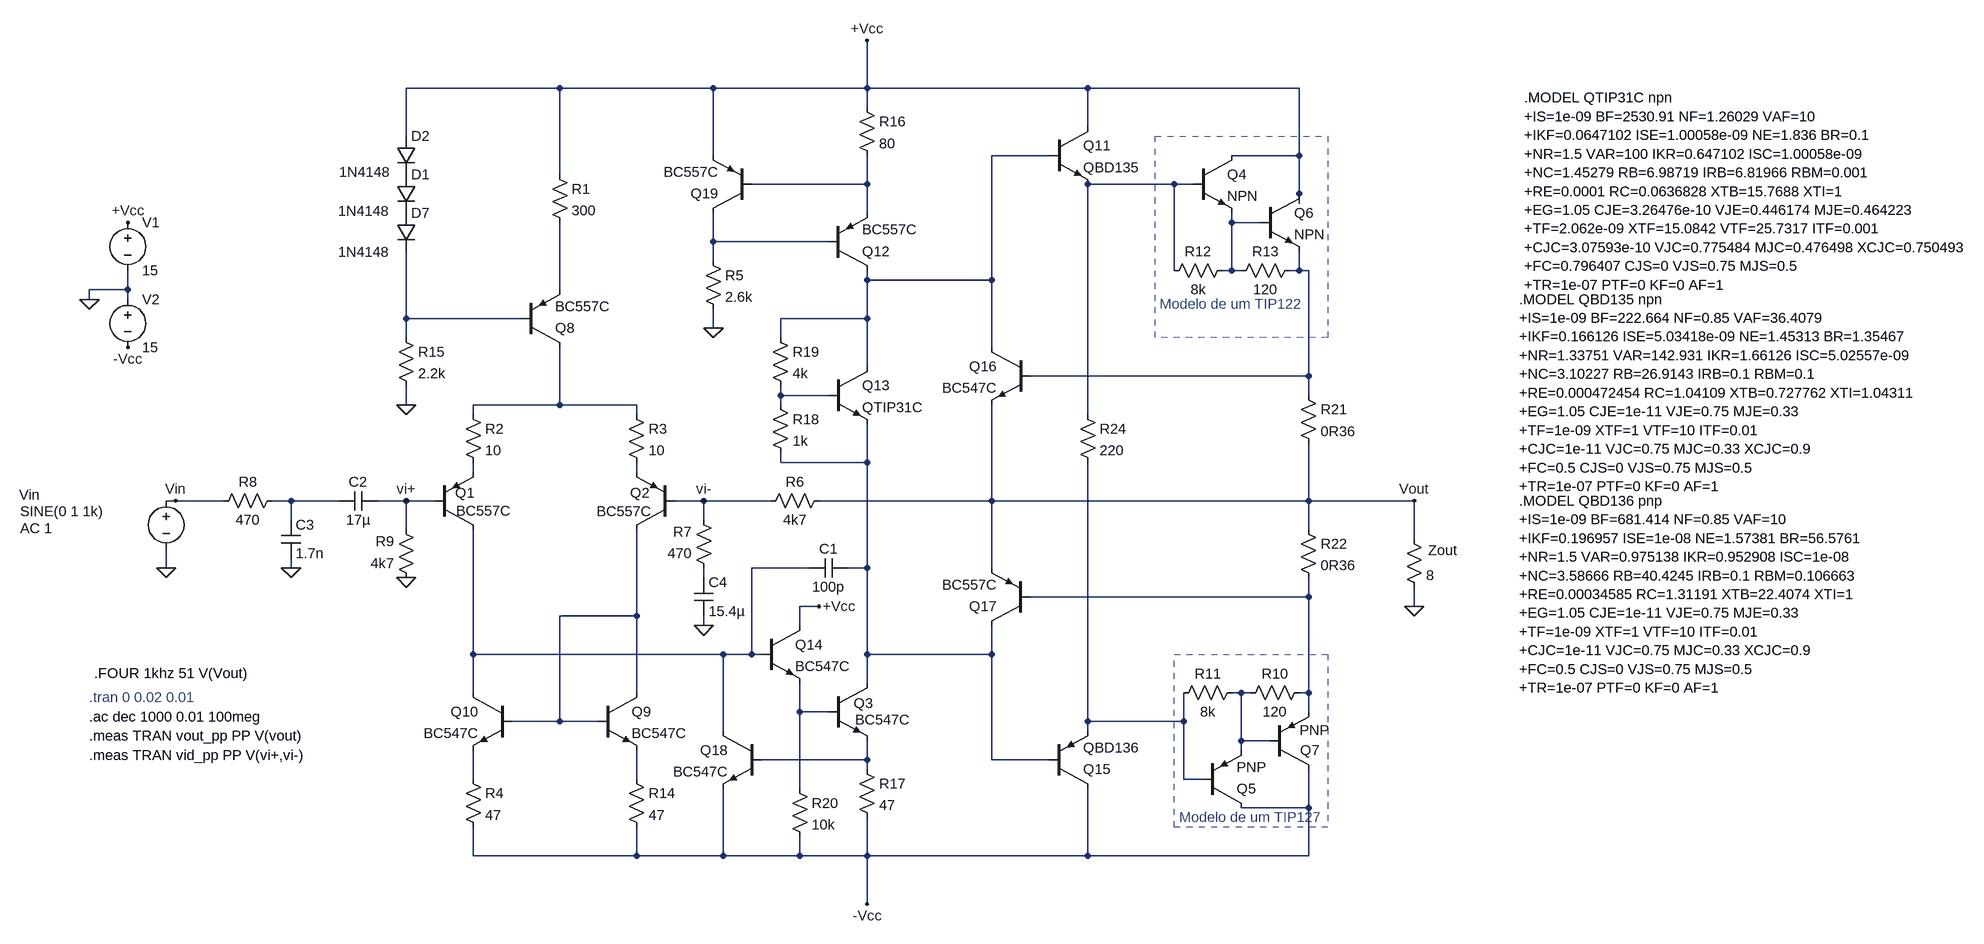
[diagram p0: schematic Amp_v4.asc]
Amp_v4.asc, the LTspice schematic file:
Version 4.1
SHEET 1 2972 1472
WIRE 112 -528 -144 -528
WIRE 368 -528 112 -528
WIRE 624 -528 624 -608
WIRE 624 -528 368 -528
WIRE 992 -528 624 -528
WIRE 1344 -528 992 -528
WIRE 624 -496 624 -528
WIRE 992 -464 992 -528
WIRE -144 -448 -144 -528
WIRE 368 -416 368 -528
WIRE 928 -416 832 -416
WIRE 1344 -416 1344 -528
WIRE 1344 -416 1232 -416
WIRE 112 -384 112 -528
WIRE 624 -368 624 -416
WIRE 624 -368 432 -368
WIRE 1136 -368 992 -368
WIRE 1168 -368 1136 -368
WIRE 1344 -352 1344 -416
WIRE 1344 -336 1344 -352
WIRE 624 -320 624 -368
WIRE 1232 -304 1232 -320
WIRE 1280 -304 1232 -304
WIRE 368 -272 368 -320
WIRE 560 -272 368 -272
WIRE 368 -240 368 -272
WIRE 1136 -224 1136 -368
WIRE 1232 -224 1232 -304
WIRE 1232 -224 1216 -224
WIRE 1248 -224 1232 -224
WIRE 1344 -224 1344 -256
WIRE 1344 -224 1328 -224
WIRE 1360 -224 1344 -224
WIRE 624 -208 624 -224
WIRE 832 -208 832 -416
WIRE 832 -208 624 -208
WIRE -608 -192 -608 -224
WIRE -608 -192 -672 -192
WIRE 112 -192 112 -304
WIRE -672 -176 -672 -192
WIRE -608 -176 -608 -192
WIRE -144 -144 -144 -256
WIRE 48 -144 -144 -144
WIRE 624 -144 624 -208
WIRE 624 -144 480 -144
WIRE 368 -128 368 -160
WIRE -144 -112 -144 -144
WIRE 480 -112 480 -144
WIRE 832 -96 832 -208
WIRE 624 -64 624 -144
WIRE 1360 -48 1360 -224
WIRE 1360 -48 896 -48
WIRE 480 -16 480 -32
WIRE 560 -16 480 -16
WIRE 1360 -16 1360 -48
WIRE -144 0 -144 -32
WIRE 112 0 112 -96
WIRE 112 0 -32 0
WIRE 240 0 112 0
WIRE 480 0 480 -16
WIRE -32 16 -32 0
WIRE 240 16 240 0
WIRE 992 16 992 -368
WIRE 480 96 480 80
WIRE 624 96 624 32
WIRE 624 96 480 96
WIRE -32 112 -32 96
WIRE 240 112 240 96
WIRE -528 160 -544 160
WIRE -448 160 -528 160
WIRE -336 160 -368 160
WIRE -256 160 -336 160
WIRE -144 160 -192 160
WIRE -96 160 -144 160
WIRE 352 160 304 160
WIRE 464 160 352 160
WIRE 832 160 832 0
WIRE 832 160 544 160
WIRE 1360 160 1360 64
WIRE 1360 160 832 160
WIRE 1536 160 1360 160
WIRE -336 192 -336 160
WIRE 352 192 352 160
WIRE -144 208 -144 160
WIRE 1360 208 1360 160
WIRE 1536 224 1536 160
WIRE -544 272 -544 240
WIRE -336 272 -336 256
WIRE 528 272 432 272
WIRE 624 272 624 96
WIRE 624 272 592 272
WIRE 832 272 832 160
WIRE 352 288 352 272
WIRE 1360 320 1360 288
WIRE 1360 320 896 320
WIRE 544 336 512 336
WIRE 1536 336 1536 304
WIRE 240 352 240 208
WIRE 240 352 112 352
WIRE 352 368 352 352
WIRE 512 368 512 336
WIRE -32 416 -32 208
WIRE 384 416 -32 416
WIRE 432 416 432 272
WIRE 432 416 384 416
WIRE 448 416 432 416
WIRE 624 416 624 272
WIRE 832 416 832 368
WIRE 832 416 624 416
WIRE 624 464 624 416
WIRE -32 480 -32 416
WIRE 240 480 240 352
WIRE 1248 480 1232 480
WIRE 1264 480 1248 480
WIRE 1360 480 1360 320
WIRE 1360 480 1344 480
WIRE 512 512 512 464
WIRE 560 512 512 512
WIRE 1360 512 1360 480
WIRE 112 528 112 352
WIRE 112 528 32 528
WIRE 176 528 112 528
WIRE 992 528 992 96
WIRE 1152 528 1152 480
WIRE 1152 528 992 528
WIRE 384 544 384 416
WIRE 992 544 992 528
WIRE 1248 560 1248 480
WIRE 1296 560 1248 560
WIRE 1248 576 1248 560
WIRE 624 592 624 560
WIRE 624 592 448 592
WIRE 832 592 832 416
WIRE 928 592 832 592
WIRE 624 608 624 592
WIRE -32 624 -32 576
WIRE 240 624 240 576
WIRE 1152 624 1152 528
WIRE 1184 624 1152 624
WIRE 512 640 512 512
WIRE 1360 672 1360 608
WIRE 1360 672 1248 672
WIRE -32 752 -32 704
WIRE 240 752 240 704
WIRE 240 752 -32 752
WIRE 384 752 384 640
WIRE 384 752 240 752
WIRE 512 752 512 720
WIRE 512 752 384 752
WIRE 624 752 624 688
WIRE 624 752 512 752
WIRE 992 752 992 640
WIRE 992 752 624 752
WIRE 1360 752 1360 672
WIRE 1360 752 992 752
WIRE 624 832 624 752
FLAG -544 272 0
FLAG -672 -176 0
FLAG -608 -304 +Vcc
FLAG 624 -608 +Vcc
FLAG -608 -96 -Vcc
FLAG 624 832 -Vcc
FLAG -144 288 0
FLAG 352 368 0
FLAG 1536 160 Vout
FLAG 1536 336 0
FLAG -144 0 0
FLAG 368 -128 0
FLAG -144 160 vi+
FLAG 352 160 vi-
FLAG -528 160 Vin
FLAG -336 272 0
FLAG 544 336 +Vcc
SYMBOL voltage -608 -320 R0
WINDOW 123 24 44 Left 2
WINDOW 39 0 0 Left 0
SYMATTR InstName V1
SYMATTR Value 15
SYMBOL voltage -608 -192 R0
WINDOW 123 0 0 Left 0
WINDOW 39 0 0 Left 0
SYMATTR InstName V2
SYMATTR Value 15
SYMBOL voltage -544 144 R0
WINDOW 123 -243 62 Left 2
WINDOW 39 24 152 Left 0
WINDOW 0 -245 6 Left 2
WINDOW 3 -243 34 Left 2
SYMATTR Value2 AC 1
SYMATTR InstName Vin
SYMATTR Value SINE(0 1 1k)
SYMBOL res -48 0 R0
SYMATTR InstName R2
SYMATTR Value 10
SYMBOL res 224 0 R0
SYMATTR InstName R3
SYMATTR Value 10
SYMBOL res 560 144 R90
WINDOW 0 0 56 VBottom 2
WINDOW 3 32 56 VTop 2
SYMATTR InstName R6
SYMATTR Value 4k7
SYMBOL res 368 288 R180
WINDOW 0 36 76 Left 2
WINDOW 3 36 40 Left 2
SYMATTR InstName R7
SYMATTR Value 470
SYMBOL res 1360 464 R90
WINDOW 0 0 56 VBottom 2
WINDOW 3 32 56 VTop 2
SYMATTR InstName R10
SYMATTR Value 120
SYMBOL res 1248 464 R90
WINDOW 0 0 56 VBottom 2
WINDOW 3 32 56 VTop 2
SYMATTR InstName R11
SYMATTR Value 8k
SYMBOL res 1232 -240 R90
WINDOW 0 0 56 VBottom 2
WINDOW 3 32 56 VTop 2
SYMATTR InstName R12
SYMATTR Value 8k
SYMBOL res 1344 -240 R90
WINDOW 0 0 56 VBottom 2
WINDOW 3 32 56 VTop 2
SYMATTR InstName R13
SYMATTR Value 120
SYMBOL cap 592 256 R90
WINDOW 0 0 32 VBottom 2
WINDOW 3 32 32 VTop 2
SYMATTR InstName C1
SYMATTR Value 100p
SYMBOL npn 560 464 R0
WINDOW 0 42 34 Left 2
WINDOW 3 44 61 Left 2
SYMATTR InstName Q3
SYMATTR Value BC547C
SYMBOL npn 1168 -416 R0
SYMATTR InstName Q4
SYMBOL pnp 1184 672 M180
SYMATTR InstName Q5
SYMBOL npn 1280 -352 R0
SYMATTR InstName Q6
SYMBOL pnp 1296 608 M180
WINDOW 0 50 32 Left 2
WINDOW 3 49 65 Left 2
SYMATTR InstName Q7
SYMBOL pnp -96 208 M180
WINDOW 0 34 61 Left 2
WINDOW 3 35 31 Left 2
SYMATTR InstName Q1
SYMATTR Value BC557C
SYMBOL pnp 304 208 R180
WINDOW 0 42 61 Left 2
WINDOW 3 40 30 Left 2
SYMATTR InstName Q2
SYMATTR Value BC557C
SYMBOL res -352 144 R90
WINDOW 0 0 56 VBottom 2
WINDOW 3 32 56 VTop 2
SYMATTR InstName R8
SYMATTR Value 470
SYMBOL res -128 304 R180
WINDOW 0 36 76 Left 2
WINDOW 3 36 40 Left 2
SYMATTR InstName R9
SYMATTR Value 4k7
SYMBOL res 1520 208 R0
WINDOW 0 39 35 Left 2
SYMATTR InstName Zout
SYMATTR Value 8
SYMBOL res -160 -128 R0
SYMATTR InstName R15
SYMATTR Value 2.2k
SYMBOL res 96 -400 R0
SYMATTR InstName R1
SYMATTR Value 300
SYMBOL pnp 48 -96 M180
SYMATTR InstName Q8
SYMATTR Value BC557C
SYMBOL diode -160 -320 R0
WINDOW 3 -97 65 Left 2
SYMATTR Value 1N4148
SYMATTR InstName D7
SYMBOL npn 176 480 R0
SYMATTR InstName Q9
SYMATTR Value BC547C
SYMBOL npn 32 480 M0
SYMATTR InstName Q10
SYMATTR Value BC547C
SYMBOL res -48 608 R0
SYMATTR InstName R4
SYMATTR Value 47
SYMBOL res 224 608 R0
SYMATTR InstName R14
SYMATTR Value 47
SYMBOL res 352 -256 R0
SYMATTR InstName R5
SYMATTR Value 2.6k
SYMBOL pnp 560 -224 M180
SYMATTR InstName Q12
SYMATTR Value BC557C
SYMBOL res 608 592 R0
SYMATTR InstName R17
SYMATTR Value 47
SYMBOL npn 560 -64 R0
SYMATTR InstName Q13
SYMATTR Value QTIP31C
SYMBOL res 464 -16 R0
SYMATTR InstName R18
SYMATTR Value 1k
SYMBOL res 464 -128 R0
SYMATTR InstName R19
SYMATTR Value 4k
SYMBOL npn 448 368 R0
SYMATTR InstName Q14
SYMATTR Value BC547C
SYMBOL res 496 624 R0
SYMATTR InstName R20
SYMATTR Value 10k
SYMBOL diode -160 -384 R0
WINDOW 3 -97 61 Left 2
SYMATTR Value 1N4148
SYMATTR InstName D1
SYMBOL diode -160 -448 R0
WINDOW 3 -96 60 Left 2
SYMATTR Value 1N4148
SYMATTR InstName D2
SYMBOL res 1344 -32 R0
SYMATTR InstName R21
SYMATTR Value 0R36
SYMBOL npn 928 -464 R0
SYMATTR InstName Q11
SYMATTR Value QBD135
SYMBOL pnp 928 640 M180
SYMATTR InstName Q15
SYMATTR Value QBD136
SYMBOL npn 896 -96 M0
SYMATTR InstName Q16
SYMATTR Value BC547C
SYMBOL pnp 896 368 R180
SYMATTR InstName Q17
SYMATTR Value BC557C
SYMBOL res 1344 192 R0
SYMATTR InstName R22
SYMATTR Value 0R36
SYMBOL res 976 0 R0
SYMATTR InstName R24
SYMATTR Value 220
SYMBOL npn 448 544 M0
SYMATTR InstName Q18
SYMATTR Value BC547C
SYMBOL cap 336 288 R0
SYMATTR InstName C4
SYMATTR Value 15.4µ
SYMBOL cap -192 144 R90
WINDOW 0 0 32 VBottom 2
WINDOW 3 32 32 VTop 2
SYMATTR InstName C2
SYMATTR Value 17µ
SYMBOL cap -352 192 R0
SYMATTR InstName C3
SYMATTR Value 1.7n
SYMBOL pnp 432 -320 R180
SYMATTR InstName Q19
SYMATTR Value BC557C
SYMBOL res 608 -512 R0
SYMATTR InstName R16
SYMATTR Value 80
TEXT -672 488 Left 2 ;.tran 0 0.02 0.01
TEXT -664 448 Left 2 !.FOUR 1khz 51 V(Vout)
TEXT 1112 -168 Left 2 ;Modelo de um TIP122
TEXT 1144 688 Left 2 ;Modelo de um TIP127
TEXT -672 520 Left 2 !.ac dec 1000 0.01 100meg
TEXT -672 552 Left 2 !.meas TRAN vout_pp PP V(vout)
TEXT -672 584 Left 2 !.meas TRAN vid_pp PP V(vi+,vi-)
TEXT 2136 -512 Left 2 !.MODEL QTIP31C npn\n+IS=1e-09 BF=2530.91 NF=1.26029 VAF=10\n+IKF=0.0647102 ISE=1.00058e-09 NE=1.836 BR=0.1\n+NR=1.5 VAR=100 IKR=0.647102 ISC=1.00058e-09\n+NC=1.45279 RB=6.98719 IRB=6.81966 RBM=0.001\n+RE=0.0001 RC=0.0636828 XTB=15.7688 XTI=1\n+EG=1.05 CJE=3.26476e-10 VJE=0.446174 MJE=0.464223\n+TF=2.062e-09 XTF=15.0842 VTF=25.7317 ITF=0.001\n+CJC=3.07593e-10 VJC=0.775484 MJC=0.476498 XCJC=0.750493\n+FC=0.796407 CJS=0 VJS=0.75 MJS=0.5\n+TR=1e-07 PTF=0 KF=0 AF=1
TEXT 2128 -176 Left 2 !.MODEL QBD135 npn\n+IS=1e-09 BF=222.664 NF=0.85 VAF=36.4079\n+IKF=0.166126 ISE=5.03418e-09 NE=1.45313 BR=1.35467\n+NR=1.33751 VAR=142.931 IKR=1.66126 ISC=5.02557e-09\n+NC=3.10227 RB=26.9143 IRB=0.1 RBM=0.1\n+RE=0.000472454 RC=1.04109 XTB=0.727762 XTI=1.04311\n+EG=1.05 CJE=1e-11 VJE=0.75 MJE=0.33\n+TF=1e-09 XTF=1 VTF=10 ITF=0.01\n+CJC=1e-11 VJC=0.75 MJC=0.33 XCJC=0.9\n+FC=0.5 CJS=0 VJS=0.75 MJS=0.5\n+TR=1e-07 PTF=0 KF=0 AF=1
TEXT 2128 160 Left 2 !.MODEL QBD136 pnp\n+IS=1e-09 BF=681.414 NF=0.85 VAF=10\n+IKF=0.196957 ISE=1e-08 NE=1.57381 BR=56.5761\n+NR=1.5 VAR=0.975138 IKR=0.952908 ISC=1e-08\n+NC=3.58666 RB=40.4245 IRB=0.1 RBM=0.106663\n+RE=0.00034585 RC=1.31191 XTB=22.4074 XTI=1\n+EG=1.05 CJE=1e-11 VJE=0.75 MJE=0.33\n+TF=1e-09 XTF=1 VTF=10 ITF=0.01\n+CJC=1e-11 VJC=0.75 MJC=0.33 XCJC=0.9\n+FC=0.5 CJS=0 VJS=0.75 MJS=0.5\n+TR=1e-07 PTF=0 KF=0 AF=1
RECTANGLE Normal 1392 -112 1104 -448 2
RECTANGLE Normal 1392 704 1136 416 2

The netlist it stands for:
* Amp_v4.asc
V1 +Vcc 0 15
V2 0 -Vcc 15
Vin Vin 0 SINE(0 1 1k) AC 1
R2 N010 N012 10
R3 N010 N013 10
R6 Vout vi- 4k7
R7 N016 vi- 470
R10 N017 N019 120
R11 N019 N021 8k
R12 N004 N003 8k
R13 N006 N004 120
C1 N011 N015 100p
Q3 N011 N020 N022 0 BC547C
Q4 +Vcc N003 N004 0 NPN
Q5 -Vcc N021 N019 0 PNP
Q6 +Vcc N004 N006 0 NPN
Q7 -Vcc N019 N017 0 PNP
Q1 N015 vi+ N012 0 BC557C
Q2 N018 vi- N013 0 BC557C
R8 N014 Vin 470
R9 0 vi+ 4k7
R§Zout Vout 0 8
R15 N008 0 2.2k
R1 +Vcc N007 300
Q8 N010 N008 N007 0 BC557C
D7 P001 N008 1N4148
Q9 N018 N018 N024 0 BC547C
Q10 N015 N018 N023 0 BC547C
R4 N023 -Vcc 47
R14 N024 -Vcc 47
R5 N005 0 2.6k
Q12 N001 N005 N002 0 BC557C
R17 N022 -Vcc 47
Q13 N001 N009 N011 0 QTIP31C
R18 N009 N011 1k
R19 N001 N009 4k
Q14 +Vcc N015 N020 0 BC547C
R20 N020 -Vcc 10k
D1 P002 P001 1N4148
D2 +Vcc P002 1N4148
R21 N006 Vout 0R36
Q11 +Vcc N001 N003 0 QBD135
Q15 -Vcc N011 N021 0 QBD136
Q16 N001 N006 Vout 0 BC547C
Q17 N011 N017 Vout 0 BC557C
R22 Vout N017 0R36
R24 N003 N021 220
Q18 N015 N022 -Vcc 0 BC547C
C4 N016 0 15.4µ
C2 vi+ N014 17µ
C3 N014 0 1.7n
Q19 N005 N002 +Vcc 0 BC557C
R16 +Vcc N002 80
.model D D
.lib standard.dio
.model NPN NPN
.model PNP PNP
.lib standard.bjt
* .tran 0 0.02 0.01
.FOUR 1khz 51 V(Vout)
* Modelo de um TIP122
* Modelo de um TIP127
.ac dec 1000 0.01 100meg
.meas TRAN vout_pp PP V(vout)
.meas TRAN vid_pp PP V(vi+,vi-)
.MODEL QTIP31C npn
+IS=1e-09 BF=2530.91 NF=1.26029 VAF=10
+IKF=0.0647102 ISE=1.00058e-09 NE=1.836 BR=0.1
+NR=1.5 VAR=100 IKR=0.647102 ISC=1.00058e-09
+NC=1.45279 RB=6.98719 IRB=6.81966 RBM=0.001
+RE=0.0001 RC=0.0636828 XTB=15.7688 XTI=1
+EG=1.05 CJE=3.26476e-10 VJE=0.446174 MJE=0.464223
+TF=2.062e-09 XTF=15.0842 VTF=25.7317 ITF=0.001
+CJC=3.07593e-10 VJC=0.775484 MJC=0.476498 XCJC=0.750493
+FC=0.796407 CJS=0 VJS=0.75 MJS=0.5
+TR=1e-07 PTF=0 KF=0 AF=1
.MODEL QBD135 npn
+IS=1e-09 BF=222.664 NF=0.85 VAF=36.4079
+IKF=0.166126 ISE=5.03418e-09 NE=1.45313 BR=1.35467
+NR=1.33751 VAR=142.931 IKR=1.66126 ISC=5.02557e-09
+NC=3.10227 RB=26.9143 IRB=0.1 RBM=0.1
+RE=0.000472454 RC=1.04109 XTB=0.727762 XTI=1.04311
+EG=1.05 CJE=1e-11 VJE=0.75 MJE=0.33
+TF=1e-09 XTF=1 VTF=10 ITF=0.01
+CJC=1e-11 VJC=0.75 MJC=0.33 XCJC=0.9
+FC=0.5 CJS=0 VJS=0.75 MJS=0.5
+TR=1e-07 PTF=0 KF=0 AF=1
.MODEL QBD136 pnp
+IS=1e-09 BF=681.414 NF=0.85 VAF=10
+IKF=0.196957 ISE=1e-08 NE=1.57381 BR=56.5761
+NR=1.5 VAR=0.975138 IKR=0.952908 ISC=1e-08
+NC=3.58666 RB=40.4245 IRB=0.1 RBM=0.106663
+RE=0.00034585 RC=1.31191 XTB=22.4074 XTI=1
+EG=1.05 CJE=1e-11 VJE=0.75 MJE=0.33
+TF=1e-09 XTF=1 VTF=10 ITF=0.01
+CJC=1e-11 VJC=0.75 MJC=0.33 XCJC=0.9
+FC=0.5 CJS=0 VJS=0.75 MJS=0.5
+TR=1e-07 PTF=0 KF=0 AF=1
.backanno
.end